# Altium project LIFT_CARD.PrjPcb
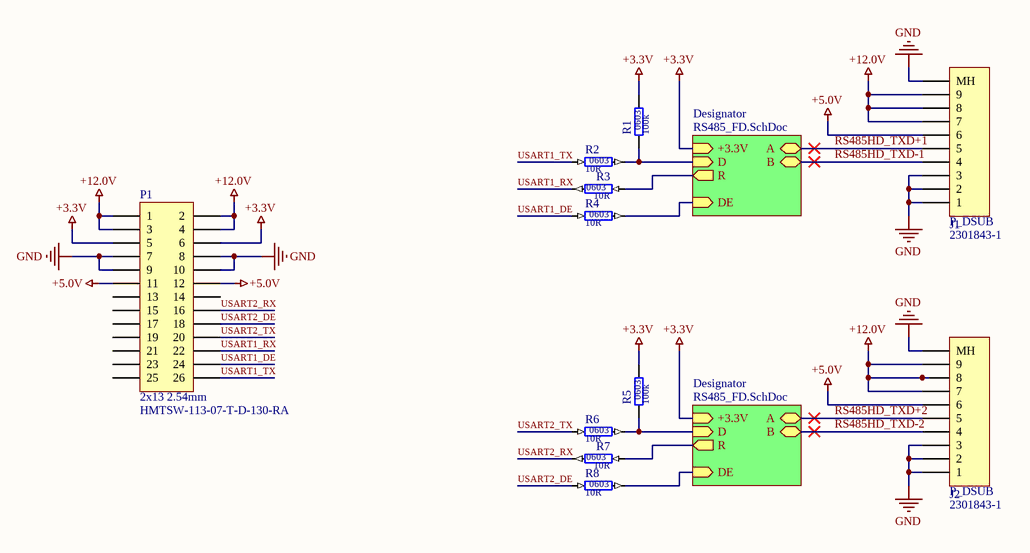
[diagram p0: LIFT_CARD.SchDoc]
2 sheets, 19 parts. Net scope: hierarchical (ports join the sheet entries above them; power ports are global).
Board file: LIFT_CARD.PcbDoc
Sheets:
  LIFT_CARD.SchDoc
    Designator = RS485_FD.SchDoc
    Designator = RS485_FD.SchDoc

## Sheet LIFT_CARD.SchDoc
size A4

### Parts
J1  value 2301843-1  SCH_Footprint: P_DSUB  [P_DSUB_2301843-1]  (hidden comment: DSUB 9 Pin)
J2  value 2301843-1  SCH_Footprint: P_DSUB  [P_DSUB_2301843-1]  (hidden comment: DSUB 9 Pin)
P1  value HMTSW-113-07-T-D-130-RA  SCH_Footprint: 2x13 2.54mm  [P_HEADER_2x13_2.54_RIGHT_ANGLE]  (hidden comment: Goldpin male)
R1  value 100k  SCH_Footprint: 0603  [R_0603_1608]  (hidden comment: Resistor)
R2  value 10R  SCH_Footprint: 0603  [R_0603_1608]  (hidden comment: Resistor)
R3  value 10R  SCH_Footprint: 0603  [R_0603_1608]  (hidden comment: Resistor)
R4  value 10R  SCH_Footprint: 0603  [R_0603_1608]  (hidden comment: Resistor)
R5  value 100k  SCH_Footprint: 0603  [R_0603_1608]  (hidden comment: Resistor)
R6  value 10R  SCH_Footprint: 0603  [R_0603_1608]  (hidden comment: Resistor)
R7  value 10R  SCH_Footprint: 0603  [R_0603_1608]  (hidden comment: Resistor)
R8  value 10R  SCH_Footprint: 0603  [R_0603_1608]  (hidden comment: Resistor)

### Sub-sheets
Designator = RS485_FD.SchDoc: +3.3V (in), R (out), D (in), DE (in), A (bidir), B (bidir)
Designator = RS485_FD.SchDoc: +3.3V (in), R (out), D (in), DE (in), A (bidir), B (bidir)

### Nets
+3.3V: P1.5 P1.6 R1.2 R5.2 ; sheet Designator/+3.3V, sheet Designator/+3.3V
+5.0V: J1.6 J2.6 P1.11 P1.12
+12.0V: J1.7 J1.8 J1.9 J2.7 J2.8 J2.9 P1.1 P1.2 P1.3 P1.4
GND: J1.1 J1.2 J1.3 J1.MH J2.1 J2.2 J2.3 J2.MH P1.7 P1.8 P1.9 P1.10
RS485HD_TXD+1: J1.5 ; sheet Designator/A
RS485HD_TXD+2: J2.5 ; sheet Designator/A
RS485HD_TXD-1: J1.4 ; sheet Designator/B
RS485HD_TXD-2: J2.4 ; sheet Designator/B
USART1_DE: P1.24 R4.1
USART1_RX: P1.22 R3.2
USART1_TX: P1.26 R2.1
USART2_DE: P1.18 R8.1
USART2_RX: P1.16 R7.2
USART2_TX: P1.20 R6.1
NetR1_1: R1.1 R2.2 ; sheet Designator/D
NetR3_1: R3.1 ; sheet Designator/R
NetR4_2: R4.2 ; sheet Designator/DE
NetR5_1: R5.1 R6.2 ; sheet Designator/D
NetR7_1: R7.1 ; sheet Designator/R
NetR8_2: R8.2 ; sheet Designator/DE

Not connected (* = marked no-connect by the designer): P1 13 14 15 17 19 21 23 25

### Library data of the parts
J1 J2 = P_DSUB_2301843-1: Header, 9-Pin; Manufacturer: TE Conectivity; Part Number: P_DSUB_2301843-1; HelpURL: https://pl.mouser.com/datasheet/2/418/1/NG_CD_2301843_H-1517790.pdf; Manufacturer Part Number: 2301843-1; Supplier 1: TME; Supplier 2: RS Components; Supplier 3: Farnell; Supplier Part Number 3: 2857982; Supplier 4: Mouser; Supplier Part Number 4: 571-2301843-1; Supplier 5: Digi-Key; Supplier Part Number 5: A132510-ND; Supplier 6: LCSC
P1 = P_HEADER_2x13_2.54_ANGLE: Pin Header; Manufacturer: Samtec; Part Number: P_HEADER_2x13_2.54_ANGLE; HelpURL: https://datasheet.octopart.com/HMTSW-113-07-T-D-130-RA-Samtec-datasheet-97080704.pdf; Manufacturer Part Number: HMTSW-113-07-T-D-130-RA; Supplier 1: TME; Supplier 2: RS Components; Supplier 3: Farnell; Supplier 4: Mouser; Supplier Part Number 4: 200-HMTSW1137TD130RA; Supplier 5: Digi-Key; Supplier Part Number 5: HMTSW-113-07-T-D-130-RA-ND; Supplier 6: LCSC
R1 R5 = R_100k_0603_1: Manufacturer: Royalohm; Manufacturer Part Number: 0603SAF1003T5E; Voltage: 50V; Power: 100mW; Tolerance: 1%; Part Number: R_100k_0603_1; HelpURL: http://www.tme.eu/pl/Document/b315665a56acbc42df513c99b390ad98/ROYALOHM-THICKFILM.pdf; Supplier 1: TME; Supplier Part Number 1: SMD0603-100K-1%; Supplier 2: RS Components; Supplier 3: Farnell; Supplier 4: Mouser; Supplier Part Number 4: 667-ERJ-3EKF1003V; Supplier 5: Digi-Key; Supplier Part Number 5: P100KHCT-ND; Supplier 6: LCSC
R2-R4 R6-R8 = R_10R_0603_1: Manufacturer: Royalohm; Manufacturer Part Number: 0603SAF100JT5E; Voltage: 50V; Power: 100mW; Tolerance: 1%; Part Number: R_10R_0603_1; HelpURL: http://www.tme.eu/pl/Document/b315665a56acbc42df513c99b390ad98/ROYALOHM-THICKFILM.pdf; Supplier 1: TME; Supplier Part Number 1: SMD0603-10R-1%; Supplier 2: RS Components; Supplier 3: Farnell; Supplier 4: Mouser; Supplier 5: Digi-Key

## Sheet RS485_FD.SchDoc
size A4
Used 2 times, as channels Designator, Designator. Parts and nets are listed once, with the designators drawn on the sheet.
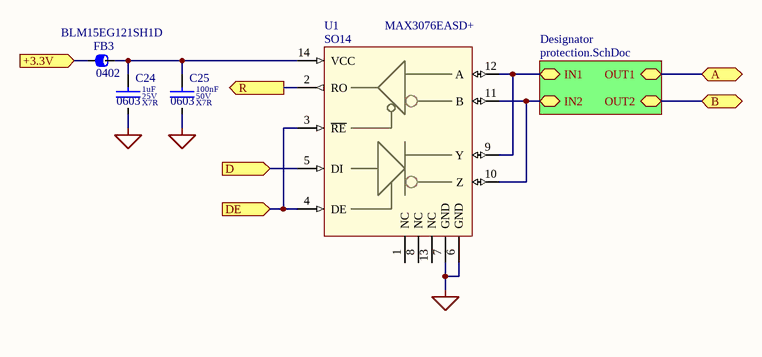
[diagram p1: RS485_FD.SchDoc]

### Parts
C24  value 1uF  Dielectric: X7R  Voltage: 25V  SCH_Footprint: 0603  [C_0603_1608]  (hidden comment: Ceramic X7R)
C25  value 100nF  Dielectric: X7R  Voltage: 50V  SCH_Footprint: 0603  [C_0603_1608]  (hidden comment: Ceramic X7R)
FB3  SCH_Footprint: 0402  Manufacturer Part Number: BLM15EG121SH1D  [FB_0402_1005]  (hidden comment: Ferrite bead)
U1  value MAX3076EASD+  SCH_Footprint: SO14  [SOP14_SO14_SOIC14_4X9X18]  (hidden comment: MAX3076 Series 16 Mbps 6 V Full Duplex SMT RS 485 Transceiver - SOIC-14)

### Sub-sheets
Designator = protection.SchDoc (file not in this document): OUT2 (bidir), IN1 (bidir), IN2 (bidir), OUT1 (bidir)

### Ports
+3.3V (in), A (bidir), B (bidir), D (in), DE (in), R (out)

### Nets
GND: C24.2 C25.2 U1.6(GND) U1.7(GND)
+3.3V: FB3.1 ; port +3.3V
A: port A, sheet Designator/OUT1
B: port B, sheet Designator/OUT2
D: U1.5(DI) ; port D
DE: U1.3(~{RE}) U1.4(DE) ; port DE
R: U1.2(RO) ; port R
NetC24_1: C24.1 C25.1 FB3.2 U1.14(VCC)
NetU1_9: U1.9(Y) U1.12(A) ; sheet Designator/IN1
NetU1_10: U1.10(Z) U1.11(B) ; sheet Designator/IN2

Not connected (* = marked no-connect by the designer): U1 1(NC) 8(NC) 13(NC)

### Channels
Designator: designators C24=C13 C25=C14 FB3=FB1 U1=U1; ports +3.3V=+3.3V A=RS485HD_TXD+1 B=RS485HD_TXD-1 D=NetR1_1 DE=NetR4_2 R=NetR3_1
Designator: designators C24=C15 C25=C16 FB3=FB2 U1=U2; ports +3.3V=+3.3V A=RS485HD_TXD+2 B=RS485HD_TXD-2 D=NetR5_1 DE=NetR8_2 R=NetR7_1

### Library data of the parts
C24 = C_1uF_25V_X7R_0603_10: Capacitor; Manufacturer: Samsung; Manufacturer Part Number: CL10B105KA8NNNC; Tolerance (%): 10; Part Number: C_1uF_25V_X7R_0603_10; HelpURL: http://www.tme.eu/pl/Document/4a42202b32dab16128fe107dd69598cc/samsung-chip-cap.pdf; Supplier 1: TME; Supplier Part Number 1: CL10B105KA8NNNC; Supplier 2: RS Components; Supplier 3: Farnell; Supplier 4: Mouser; Supplier 5: Digi-Key
C25 = C_100nF_50V_X7R_0603_5: Capacitor; Manufacturer: Samsung; Manufacturer Part Number: CL10B104JB8NNNC; Tolerance (%): 5; Part Number: C_100nF_50V_X7R_0603_5; HelpURL: http://www.tme.eu/pl/Document/4a42202b32dab16128fe107dd69598cc/samsung-chip-cap.pdf; Supplier 1: TME; Supplier Part Number 1: CL10B104JB8NNNC; Supplier 2: RS Components; Supplier 3: Farnell; Supplier 4: Mouser; Supplier 5: Digi-Key
FB3 = FB_BLM15EG121SH1D: Manufacturer: Murata; Current: 1.5A; Resistance: 95mR; Part Number: FB_BLM15EG121SH1D; Value: BLM15EG121SH1D; HelpURL: http://datasheet.octopart.com/BLM15EG121SH1D-Murata-datasheet-37129980.pdf; Supplier 1: TME; Supplier 2: RS Components; Supplier 3: Farnell; Supplier 4: Mouser; Supplier Part Number 4: 81-BLM15EG121SH1D; Supplier 5: Digi-Key; Supplier Part Number 5: 490-17344-1-ND
U1 = U_MAX3076EASD+: RS-485/RS-422 Transceivers, +3.3V,  ±15kV ESD-Protected, Fail-Safe, Hot-Swap; Manufacturer: Maxim Integrated; Part Number: U_MAX3076EASD+; HelpURL: https://sigma.octopart.com/138901689/technical_drawing/Maxim-Integrated-MAX3076EASD%2B.pdf; Manufacturer Part Number: MAX3076EASD+; Supplier 1: TME; Supplier 2: RS Components; Supplier 3: Farnell; Supplier Part Number 3: 2511650; Supplier 4: Mouser; Supplier Part Number 4: 700-MAX3076EASD; Supplier 5: Digi-Key; Supplier Part Number 5: MAX3076EASD+-ND

## Nets that join several sheets
+3.3V: LIFT_CARD (P1.5 P1.6 R1.2 R5.2), Designator (FB1.1), Designator (FB2.1)
GND: LIFT_CARD (12 pins), Designator (C13.2 C14.2 U1.6 U1.7), Designator (C15.2 C16.2 U2.6 U2.7)
NetR1_1: LIFT_CARD (R1.1 R2.2), Designator (U1.5)
NetR3_1: LIFT_CARD (R3.1), Designator (U1.2)
NetR4_2: LIFT_CARD (R4.2), Designator (U1.3 U1.4)
NetR5_1: LIFT_CARD (R5.1 R6.2), Designator (U2.5)
NetR7_1: LIFT_CARD (R7.1), Designator (U2.2)
NetR8_2: LIFT_CARD (R8.2), Designator (U2.3 U2.4)